# EasyEDA Pro project Modular-Analog-Synthesizer.eprj, schematic Schematic5
Board Name: wavefolder; Create Date: 2026-04-15; Page Name: wavefolder-circuit; Project Name: Modular-Analog-Synthesizer; Schematic Name: Schematic5; Update Date: 2026-04-15; Company: EasyEDA.com; Page Size: A4; Version: V1.0
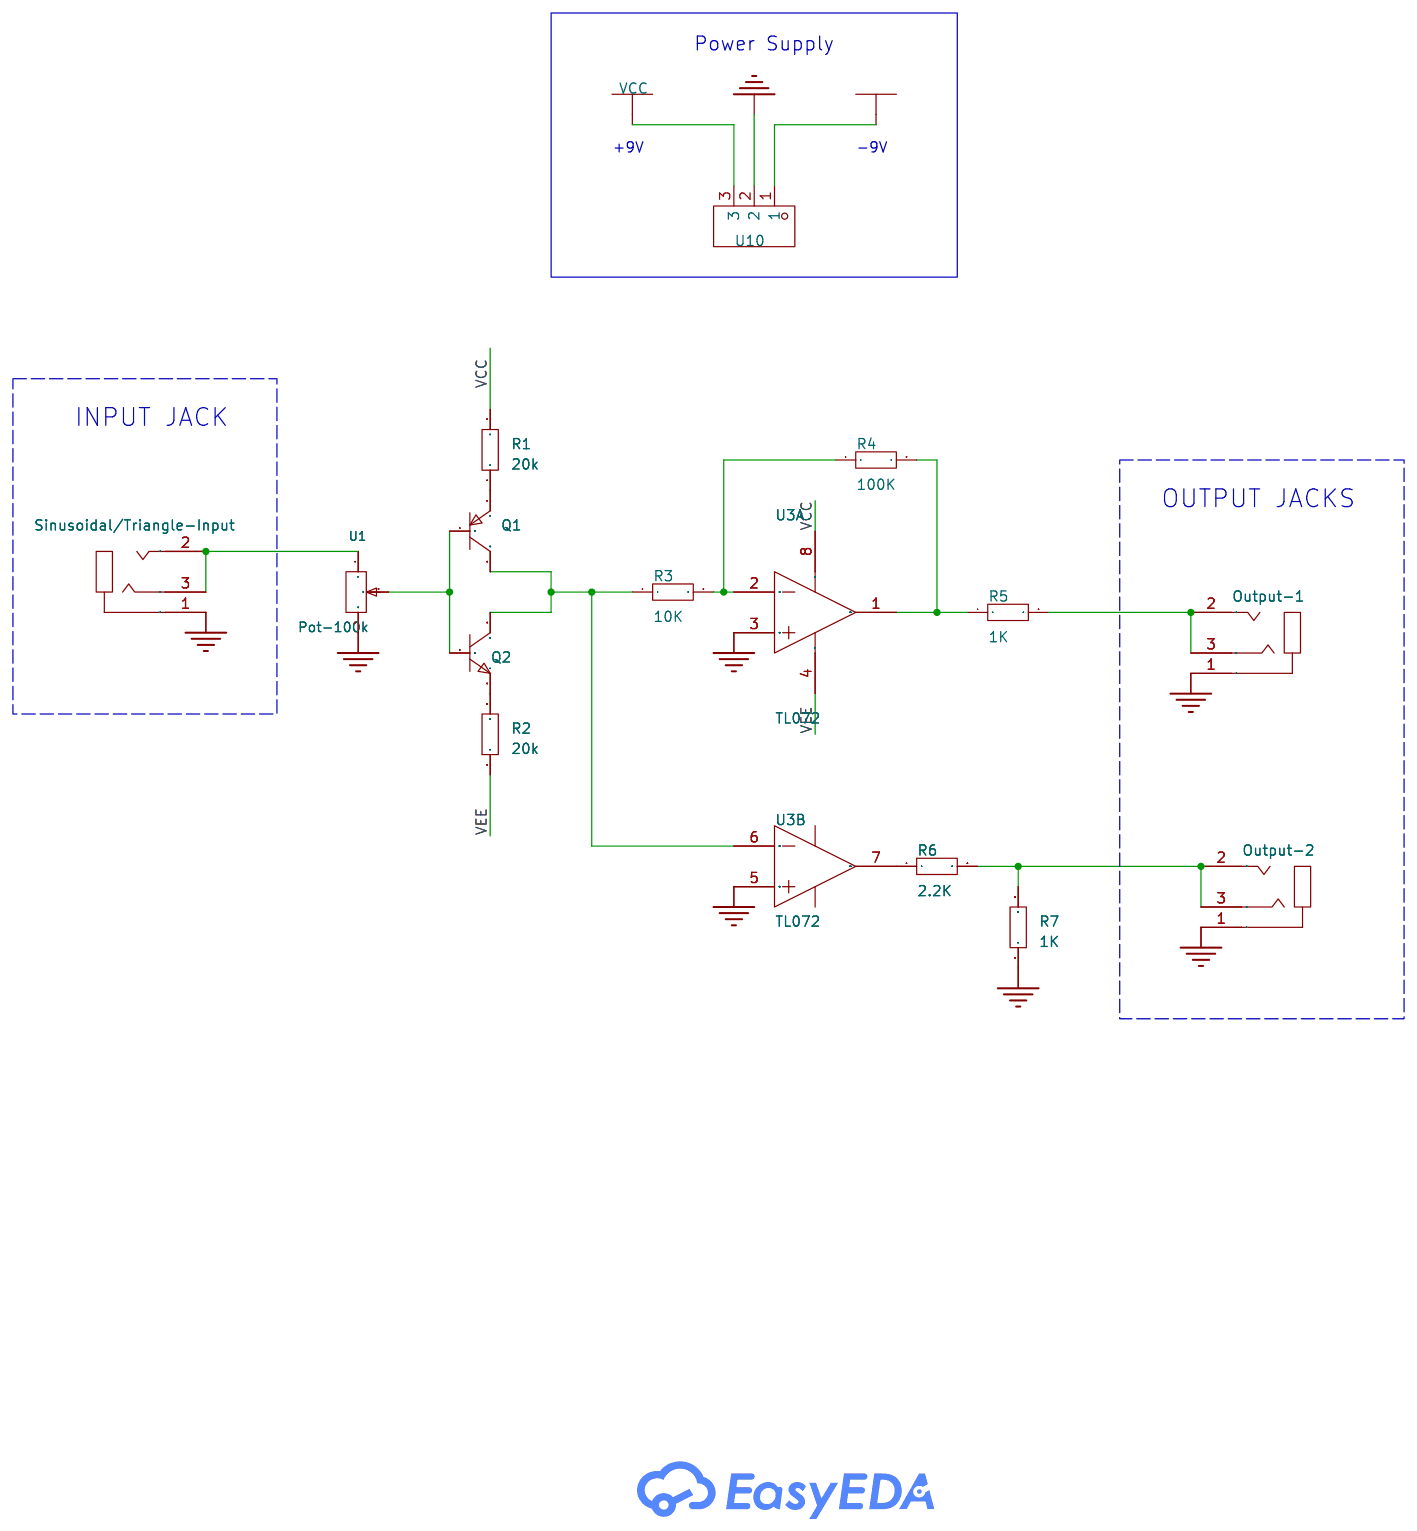
[diagram p4: schematic sheet]

## Parts
Output-1  -  [AUDIO-SMD_PJ-313D]
Output-2  -  [AUDIO-SMD_PJ-313D]
Q1  -  [SOT-23-3_L2.9-W1.3-P0.95-LS2.4-BR]
Q2  -  [SOT-23-3_L2.9-W1.3-P1.90-LS2.4-BR]
R1  20k  [R0603]
R2  20k  [R0603]
R3  10K  [R0603]
R4  100K  [R0603]
R5  1K  [R0603]
R6  2.2K  [R0603]
R7  1K  [R0603]
Sinusoidal/Triangle-Input  -  [AUDIO-SMD_PJ-313D]
U1  Pot-100k  [RES-ADJ-SMD_VG039NCH]
U3  TL072  [DIP-8_L9.7-W6.6-P2.54-LS7.6-BL]  (sections 1,2)
U10  -  [CONN-TH_3P-P5.00_KF301-5.0-3P]

## Library data of the parts
Output-1 Output-2 Sinusoidal/Triangle-Input = PJ-313D-6A: LCSC Part Name: 3.5mm耳机座; Supplier Part: C95463; Manufacturer: 韩国韩荣; Supplier Footprint: SMD; JLCPCB Part Class: Extended Part; Datasheet: https://atta.szlcsc.com/upload/public/pdf/source/20191118/C95463_33C76E25D98A90BB88D1795912C97EA2.pdf; Supplier: LCSC; Connector Type: 3.5mm耳机座; Current Rating (Max): 500mA; Voltage Rating (Max): 30V
Q1 = MMBT3906-2A: Supplier Part: C364311; Manufacturer: MDD; Manufacturer Part: PNP; Supplier Footprint: SOT-23; JLCPCB Part Class: Extended Part; Datasheet: https://atta.szlcsc.com/upload/public/pdf/source/20190125/C364311_C4170B7D690A5DC511622F512E7775F2.pdf; Supplier: LCSC; Collector-Emitter Saturation Voltage (VCE(sat)@Ic,Ib): 300mV@50mA,5mA; Transition Frequency (fT): 300MHz; Operating Temperature: +150℃@(Tj)
Q2 = MMBT5551: LCSC Part Name: MMBT5551 G1 H档200-300 G1 H档200-300; Supplier Part: C2145; Manufacturer: CJ（江苏长电/长晶）; Supplier Footprint: SOT-23(SOT-23-3); JLCPCB Part Class: Basic Part; Datasheet: https://atta.szlcsc.com/upload/public/pdf/source/20140809/1457707209203.pdf; Supplier: LCSC; Collector Cut-Off Current (Icbo): 50nA; Collector-Emitter Saturation Voltage (VCE(sat)@Ic,Ib): 200mV@50mA,5mA; DC Current Gain (hFE@Ic,Vce): 200@10mA,5V; Transition Frequency (fT): 100MHz; Operating Temperature: +150℃@(Tj)
R1-R7 = Res_0603: Supplier Footprint: 0603
U1 = 3*3Potentiometer-10kΩ20%: Supplier Part: C9900010776; Supplier Footprint: SMD-3P; JLCPCB Part Class: Extended Part; Supplier: LCSC
U3 = TL072: LCSC Part Name: 低噪声JFET输入双运放; Supplier Part: C529228; Supplier Footprint: DIP-8; JLCPCB Part Class: Extended Part; Supplier: LCSC
U10 = KF301-5.0-3P: LCSC Part Name: 5mm 排数:1 每排P数:3 直针 可拼接 铜 环保; Supplier Part: C474882; Manufacturer: KEFA(科发); Supplier Footprint: P=5mm; JLCPCB Part Class: Extended Part; Datasheet: https://atta.szlcsc.com/upload/public/pdf/source/20200115/C474882_067BD45A25E5311BED9DE634CF3E69D8.pdf; Supplier: LCSC; Pitch: 5mm; Number of Rows: 1; Number of PINs Per Row: 3; Mounting Style: 直针; Current Rating (Max): 17A; Voltage Rating (Max): 250V; Wire Gauge - AWG: 14~22; Wire Gauge - mm?: 1.5; Operating Temperature Range: -30℃~+120℃; Color: Blue

## Nets
GND: Output-1.1 Output-2.1 R7.1 Sinusoidal/Triangle-Input.1 U1.3 U3.3(1IN+) U3.5(2IN+) U10.2
VCC: R1.2 U3.8(VCC+) U10.3
VEE: R2.1 U3.4(VCC-) U10.1
$1N382: Q1.1(B) Q2.1(B) U1.2
$1N386: Q1.3(C) Q2.3(C) R3.1 U3.6(2IN-)
$1N418: Q1.2(E) R1.1
$1N854: R4.2 R5.1 U3.1(1OUT)
$1N860: R3.2 R4.1 U3.2(1IN-)
$1N1050: Output-2.2 Output-2.3 R6.2 R7.2
$1N1064: Output-1.2 Output-1.3 R5.2
$1N1428: Q2.2(E) R2.2
$1N1437: Sinusoidal/Triangle-Input.2 Sinusoidal/Triangle-Input.3 U1.1
$1N1598: R6.1 U3.7(2OUT)

## Notes on the sheet
- Power Supply
- +9V
- -9V
- INPUT JACK
- OUTPUT JACKS
